# Altium schematic sheet BEE_BOARD_POWER.SchDoc
size Tabloid; DocumentNumber: 4; SheetNumber: 4; SheetTotal: 7; Sheet_Name: POWER; Size: 11x17
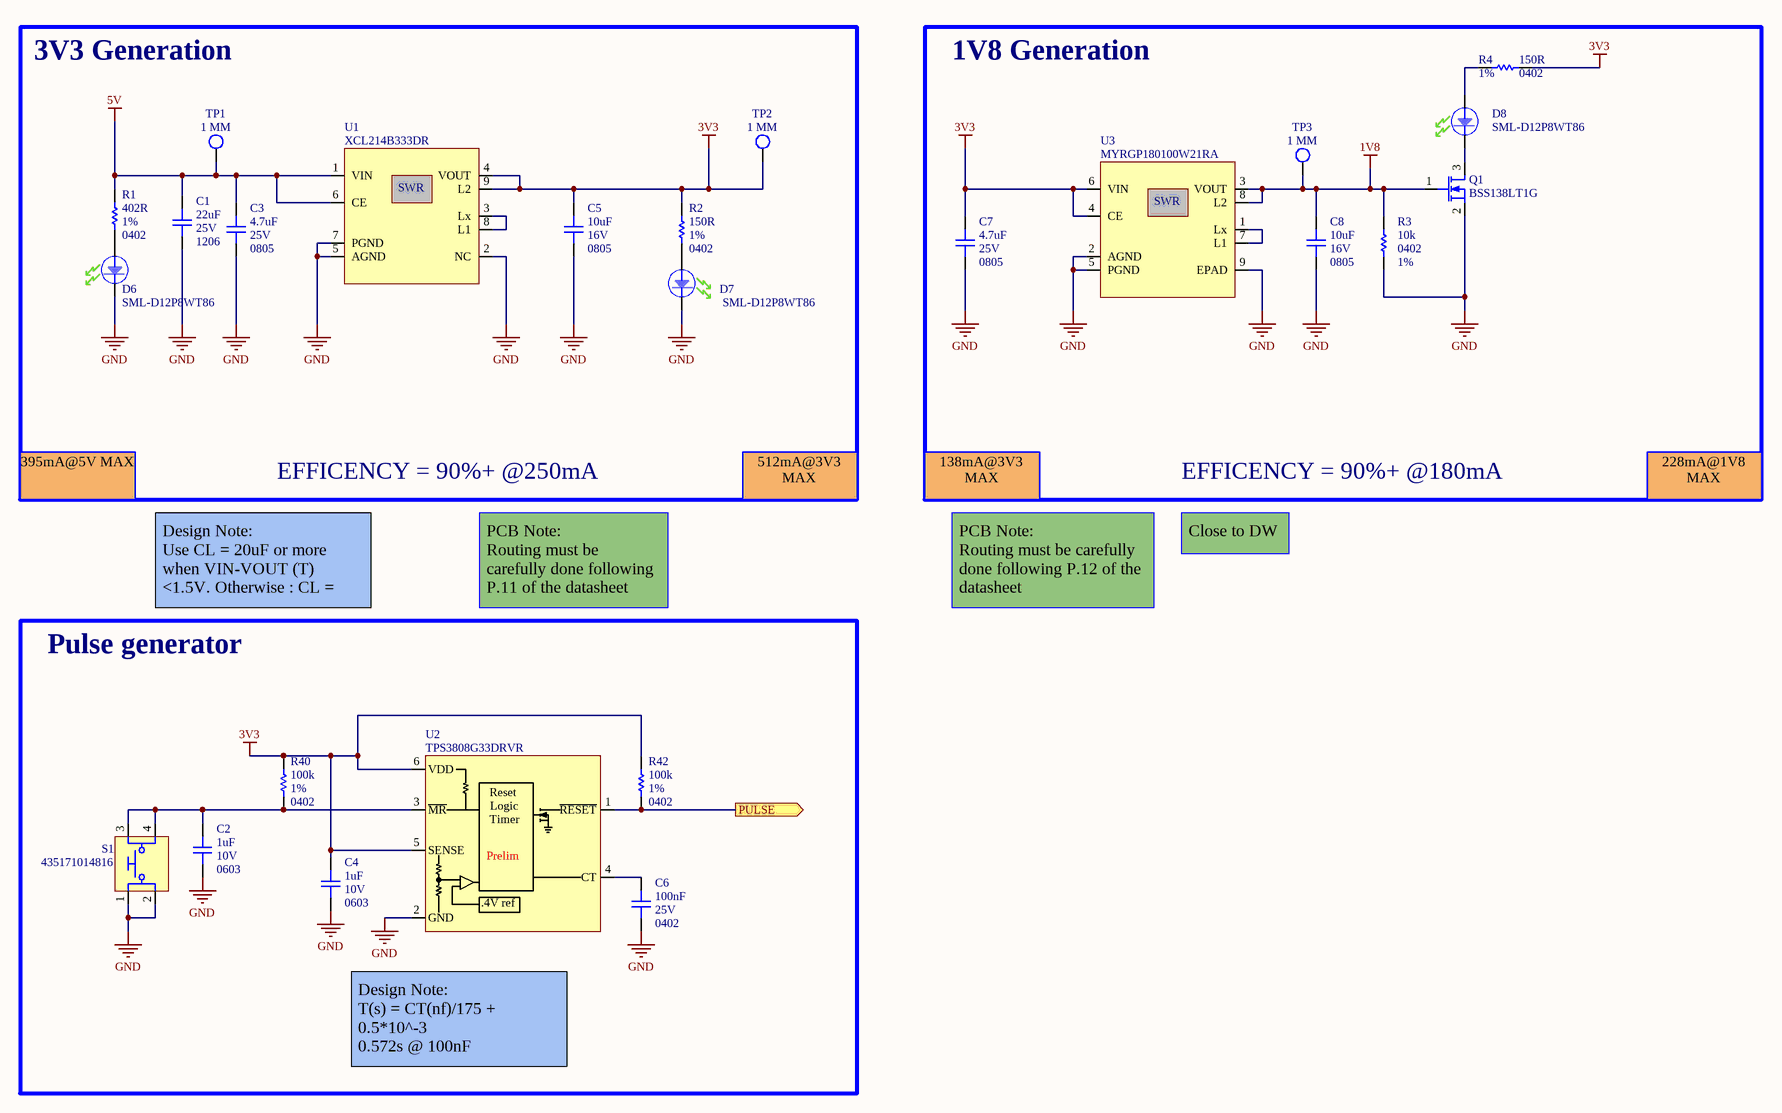
[diagram p0: BEE_BOARD_POWER.SchDoc]

## Parts
C1  value 22uF  Package: 1206  Voltage Rating: 25V  [CAP_CER_1206]  (hidden comment: CL31A226KAHNNNE)
C2  value 1uF  Package: 0603  Voltage Rating: 10V  [CAP_CER_0603]  (hidden comment: C0603C105K8PACTU)
C3  value 4.7uF  Package: 0805  Voltage Rating: 25V  [CAP_CER_0805]  (hidden comment: C2012X7R1E475K125AE)
C4  value 1uF  Package: 0603  Voltage Rating: 10V  [CAP_CER_0603]  (hidden comment: C0603C105K8PACTU)
C5  value 10uF  Package: 0805  Voltage Rating: 16V  [CAP_CER_0805]  (hidden comment: GRM21BR61C106KE15K)
C6  value 100nF  Package: 0402  Voltage Rating: 25V  [CAP_CER_0402]  (hidden comment: CGA2B3X7R1E104K050BB)
C7  value 4.7uF  Package: 0805  Voltage Rating: 25V  [CAP_CER_0805]  (hidden comment: C2012X7R1E475K125AE)
C8  value 10uF  Package: 0805  Voltage Rating: 16V  [CAP_CER_0805]  (hidden comment: GRM21BR61C106KE15K)
D6  SML-D12P8WT86  [LED_SML-D12P8WT86]
D7  SML-D12P8WT86  [LED_SML-D12P8WT86]
D8  SML-D12P8WT86  [LED_SML-D12P8WT86]
Q1  BSS138LT1G  [TRX_NMOS_BSS138LT1G]
R1  value 402R  Tolerance: 1%  Package: 0402  [RES_0402]  (hidden comment: ERJ-2RKF4020X)
R2  value 150R  Tolerance: 1%  Package: 0402  [RES_0402]  (hidden comment: RC0402FR-07150RL)
R3  value 10k  Tolerance: 1%  Package: 0402  [RES_0402]  (hidden comment: RC0402FR-0710KL)
R4  value 150R  Tolerance: 1%  Package: 0402  [RES_0402]  (hidden comment: RC0402FR-07150RL)
R40  value 100k  Tolerance: 1%  Package: 0402  [RES_0402]  (hidden comment: RC0402FR-07100KL)
R42  value 100k  Tolerance: 1%  Package: 0402  [RES_0402]  (hidden comment: RC0402FR-07100KL)
S1  435171014816  [SWI_TACT_435171014816]
TP1  1 MM  [TPO_SMD_ROUND_1MM]  (no BOM)
TP2  1 MM  [TPO_SMD_ROUND_1MM]  (no BOM)
TP3  1 MM  [TPO_SMD_ROUND_1MM]  (no BOM)
U1  XCL214B333DR  [REG_SWR_XCL214B333DR]
U2  TPS3808G33DRVR  [POW_TPS3808G33DRVR]
U3  MYRGP180100W21RA  [REG_SWR_MYRGP180100W21RA]

## Blocks framed on the sheet
3V3 Generation: C1 C3 C5 D6 D7 R1 R2 TP1 TP2 U1
1V8 Generation: C7 C8 D8 Q1 R3 R4 TP3 U3
Pulse generator: C2 C4 C6 R40 R42 S1 U2

## Ports
PULSE (out)

## Nets
1V8: C8.2 Q1.1(G) R3.1 TP3.1 U3.3(VOUT) U3.8(L2)
3V3: C4.1 C5.2 C7.2 R2.2 R4.1 R40.2 R42.2 TP2.1 U1.4(VOUT) U1.9(L2) U2.5(SENSE) U2.6(VDD) U3.4(CE) U3.6(VIN)
5V: C1.2 C3.2 R1.2 TP1.1 U1.1(VIN) U1.6(CE)
GND: C1.1 C2.2 C3.1 C4.2 C5.1 C6.1 C7.1 C8.1 D6.K D7.K Q1.2(S) R3.2 S1.1 S1.2 U1.2(NC) U1.5(AGND) U1.7(PGND) U2.2(GND) U3.2(AGND) U3.5(PGND) U3.9(EPAD)
PULSE: R42.1 U2.1(~{RESET}) ; port PULSE
NetC2_1: C2.1 R40.1 S1.3 S1.4 U2.3(~{MR})
NetC6_2: C6.2 U2.4(CT)
NetD6_A: D6.A R1.1
NetD7_A: D7.A R2.1
NetD8_A: D8.A R4.2
NetD8_K: D8.K Q1.3(D)
NetU1_3: U1.3(Lx) U1.8(L1)
NetU3_1: U3.1(Lx) U3.7(L1)

## Notes on the sheet
- 395mA@5V MAX
- EFFICENCY = 90%+ @250mA
- 512mA@3V3 MAX
- 138mA@3V3 MAX
- EFFICENCY = 90%+ @180mA
- 228mA@1V8 MAX
- Design Note:
  Use CL = 20uF or more when VIN-VOUT (T) <1.5V. Otherwise : CL = 10uF
- PCB Note:
  Routing must be carefully done following P.11 of the datasheet
- PCB Note:
  Routing must be carefully done following P.12 of the datasheet
- Close to DW
- Design Note:
  T(s) = CT(nf)/175 + 0.5*10^-3
  0.572s @ 100nF
- Sheet Name
- Project Title
- Global Project
- Size
- Group
- Revision
- Date
- Sheet
- of
- Filename
- Designers
- (in symbol POW_TPS3808G33DRVR) Reset; Logic; Timer; Prelim; .4V ref
- (in symbol REG_SWR_MYRGP180100W21RA) SWR
- (in symbol REG_SWR_XCL214B333DR) SWR

## Library data of the parts
C1 = CAP_CER_CL31A226KAHNNNE: CAP - CER 22uF 10% 25V X5R - 1206; Manufacturer #1: Samsung Electro-Mechanics; GRAMS Lib Spec: 2.8; Magnetic Material: Unknown; Polarized: NO; Assembly Type: SMD; CreatedBy/Date: Philippe Arsenault/21 Janvier 2020; Current Rating: *; HelpURL: http://www.samsungsem.com/global/support/product-search/mlcc/1207445_4880.html; Manufacturer #2: *; Note: *; Part Number #1: CL31A226KAHNNNE; Part Number #2: 1276-3047-1-ND; Power Max: *; Temperature: -55°C ~ 85°C; Tolerance: 10%; VerifiedBy: C.Paulin - 28/01/2020; Supplier 1: Digi-Key; Supplier Part Number 1: 1276-3047-1-ND; Cryo: UNKNOWN
C2 C4 = CAP_CER_C0603C105K8PACTU: CAP - CER 1uF 10V 10% X5R - 0603; Manufacturer #1: KEMET; GRAMS Lib Spec: 2.8; Magnetic Material: Unknown; Polarized: NO; Tolerance: 10%; Current Rating: *; Power Max: *; HelpURL: https://content.kemet.com/datasheets/KEM_C1006_X5R_SMD.pdf; CreatedBy/Date: Hubert Dube - 21/07/20; VerifiedBy: Louis-Daniel Gaulin - 21/07/20; Temperature: -55°C ~ 85°C; Manufacturer #2: *; Assembly Type: SMD; Part Number #2: *; Part Number #1: C0603C105K8PACTU; Cryo: UNKNOWN; Supplier 1: Digi-Key; Supplier Part Number 1: 399-3118-1-ND
C3 C7 = CAP_CER_C2012X7R1E475K125AE: CAP - CER 4.7UF 10% 25V X7R - 0805; Manufacturer #1: TDK Corporation; GRAMS Lib Spec: 2.8; Magnetic Material: Unknown; Polarized: No; Tolerance: 10%; Current Rating: *; Power Max: *; HelpURL: https://product.tdk.com/info/en/documents/chara_sheet/C2012X7R1E475K125AE.pdf; CreatedBy/Date: Keven Deslandes - 2018/11/09; VerifiedBy: Nicolas Roy - 2018/12/11; Temperature: -55°C ~ 125°C; Manufacturer #2: *; Note: *; Assembly Type: SMD; Part Number #2: *; Part Number #1: C2012X7R1E475K125AE; Supplier 1: Digi-Key; Supplier Part Number 1: 445-14537-1-ND; Cryo: UNKNOWN
C5 C8 = CAP_CER_GRM21BR61C106KE15K: CAP - CER 10UF 10% 16V X5R - 0805; Manufacturer #1: Murata; GRAMS Lib Spec: 2.8; Magnetic Material: Unknown; Polarized: NO; Assembly Type: SMD; CreatedBy/Date: Caroline Paulin / 8 août 2018; Current Rating: *; HelpURL: https://search.murata.co.jp/Ceramy/image/img/A01X/G101/ENG/GRM21BR61C106KE15-01.pdf; Manufacturer #2: *; Note: *; Part Number #1: GRM21BR61C106KE15K; Part Number #2: *; Power Max: *; Temperature: -55°C ~ 85°C; Tolerance: 10%; VerifiedBy: Nicolas V. (2019-01-22); Supplier 1: Digi-Key; Supplier Part Number 1: 490-6473-1-ND; Cryo: UNKNOWN
C6 = CAP_CER_CGA2B3X7R1E104K050BB: CAP - CER 0.1µF 10% 25V X7R - 0402; Manufacturer #1: TDK Corporation; GRAMS Lib Spec: 2.8; Magnetic Material: Unknown; Polarized: NO; Assembly Type: SMD; CreatedBy/Date: Nicolas Roy 2018-11-07; Current Rating: *; HelpURL: https://product.tdk.com/info/en/catalog/datasheets/mlcc_automotive_general_en.pdf; Manufacturer #2: *; Note: *; Part Number #1: CGA2B3X7R1E104K050BB; Part Number #2: *; Power Max: *; Temperature: -55°C ~ 125°C; Tolerance: 10%; VerifiedBy: Nicolas V. (2019-01-22); Supplier 1: Digi-Key; Supplier Part Number 1: 445-6902-1-ND; Cryo: UNKNOWN
D6-D8 = LED_SML-D12P8WT86: LED - GREEN DIFFUSED 0603 SMD - 0603; Manufacturer #1: Rohm Semiconductor; Current Rating: 1-20mA; Note: Operate at 2mA; Value: 560 nm (green); Voltage rating: 2.2V (Forward), 5V (max Reverse); Polarized: Yes; Magnetic Material: Unknown; GRAMS Lib Spec: 2.8; Manufacturer #2: *; Power Max: *; Part Number #1: SML-D12P8WT86; Part Number #2: *; HelpURL: https://d1d2qsbl8m0m72.cloudfront.net/en/products/databook/datasheet/opto/led/chip_mono/sml-d12x8_d13x8-e.pdf; Supplier 1: Digi-Key; Supplier Part Number 1: 511-1579-2-ND; Assembly Type: SMD; Temperature: -40 ~ 85 °C; Package: 0603; CreatedBy/Date: Keven Deslandes - 2018/11/21; Tolerance: *; VerifiedBy: Caroline Paulin - 13 février 2019; Cryo: UNKNOWN
Q1 = TRX_NMOS_BSS138LT1G: TRX - NMOS - 50V 200MA - SOT−23-3; Manufacturer #1: ON Semiconductor; GRAMS Lib Spec: 2.8; Magnetic Material: Unknown; Polarized: Yes; Power Max: 225mW; Assembly Type: SMD; CreatedBy/Date: Joel Lemay 2018-06-15; Current Rating: 200mA; HelpURL: http://www.onsemi.com/pub/Collateral/BSS138LT1-D.PDF; Manufacturer #2: *; Package: SOT-23-3; Part Number #1: BSS138LT1G; Part Number #2: *; Supplier 1: Digi-Key; Supplier Part Number 1: BSS138LT1GOSCT-ND; Temperature: -55°C ~ 150°C; Tolerance: *; Value: *; VerifiedBy: Caroline Paulin - 6 sept 2018; Voltage Rating: 50V; Cryo: UNKNOWN
R1 = RES_ERJ-2RKF4020X: RES - 402R 1% 1/10W - 0402; Manufacturer #1: Panasonic Electronic Components; GRAMS Lib Spec: 2.8; Magnetic Material: Unknown; Polarized: No; Voltage Rating: 50V; Assembly Type: SMD; CreatedBy/Date: Keven Deslandes 2018-09-20; Current Rating: *; HelpURL: https://industrial.panasonic.com/ww/products/resistors/chip-resistors/general-purpose-chip-resistors/precision-thick-film-chip-resistors/ERJ2RKF4020X; Manufacturer #2: *; Part Number #1: ERJ-2RKF4020X; Part Number #2: *; Power Max: 1/10W; Temperature: -55°C ~ 155°C; VerifiedBy: Caroline Paulin - 18/12/2018; Supplier 1: Digi-Key; Supplier Part Number 1: P402LCT-ND; Cryo: UNKNOWN
R2 R4 = RES_RC0402FR-07150RL: RES - 150R 1% 1/16W - 0402; Manufacturer #1: Yageo; GRAMS Lib Spec: 2.8; Magnetic Material: Unknown; Polarized: No; Voltage Rating: 50V; Assembly Type: SMD; CreatedBy/Date: Jonathan Bouchard 2019-03-25; Current Rating: *; HelpURL: http://www.yageo.com/documents/recent/PYu-RC_Group_51_RoHS_L_10.pdf; Manufacturer #2: *; Part Number #1: RC0402FR-07150RL; Part Number #2: *; Power Max: 1/16W; Temperature: -55°C ~ 155°C; VerifiedBy: Nicolas V. (2019-05-02); Supplier 1: Digi-Key; Supplier Part Number 1: 311-150LRCT-ND; Cryo: UNKNOWN
R3 = RES_RC0402FR-0710KL: RES - 10K OHMS 1% 1/16W - 0402; Manufacturer #1: Yageo; GRAMS Lib Spec: 2.8; Magnetic Material: UNKNOWN; Polarized: NO; Voltage Rating: 50V; Assembly Type: SMD; CreatedBy/Date: Nicolas V. (2018-11-20); Current Rating: *; HelpURL: http://www.yageo.com/documents/recent/PYu-RC_Group_51_RoHS_L_9.pdf; Manufacturer #2: *; Note: *; Part Number #1: RC0402FR-0710KL; Part Number #2: *; Power Max: 1/16W; Temperature: -55°C ~ 155°C; VerifiedBy: Nicolas V. (2018-11-20); Supplier 1: Digi-Key; Supplier Part Number 1: 311-10.0KLRCT-ND; Cryo: UNKNOWN
R40 R42 = RES_RC0402FR-07100KL: RES - 100K 1% 1/16W - 0402; Manufacturer #1: Yageo; GRAMS Lib Spec: 2.8; Magnetic Material: Unknown; Polarized: No; Voltage Rating: 50V; Assembly Type: SMD; CreatedBy/Date: Keven Deslandes 2018-10-19; Current Rating: *; HelpURL: http://www.yageo.com/documents/recent/PYu-RC_Group_51_RoHS_L_9.pdf; Manufacturer #2: *; Part Number #1: RC0402FR-07100KL; Part Number #2: *; Power Max: 1/16W; Temperature: -55°C ~ 155°C; VerifiedBy: Caroline Paulin - 18/12/2018; Supplier 1: Digi-Key; Supplier Part Number 1: 311-100KLRCT-ND; Cryo: UNKNOWN
S1 = SWI_TACT_435171014816: SWI - SWITCH TACTILE SPST-NO 0.05A 12V -SMD; Manufacturer #1: Würth Elektronik; Current Rating: 50mA; Voltage rating: 12VDC; Polarized: No; Magnetic Material: UNKNOWN; GRAMS Lib Spec: 2.8; Manufacturer #2: *; Power Max: *; Value: SPST-NO; Part Number #1: 435171014816; Part Number #2: *; HelpURL: https://www.we-online.com/catalog/datasheet/435171014816.pdf; Supplier 1: Digi-Key; Supplier Part Number 1: 732-435171014816CT-ND; Assembly Type: SMD; Temperature: -40°C ~ 85°C; Package: SMD; CreatedBy/Date: Hubert Dube - 22/07/20; Tolerance: *; VerifiedBy: Louis-Daniel Gaulin / 12-11-2020; Cryo: UNKNOWN
TP1-TP3 = TPO_SMD_ROUND_1MM: TPO - TEST POINT ROUND SMD PAD ONLY  - 1 MM; Magnetic Material: NO; GRAMS Lib Spec: 2.8; Cryo: UNKNOWN; Current Rating: *; Manufacturer #1: *; Manufacturer #2: *; Note: *; Power Max: *; Value: *; Part Number #1: *; Part Number #2: *; HelpURL: *; Polarized: *; Supplier 1: *; Assembly Type: NONE; Supplier Part Number 1: *; Package: 1 MM ROUND; CreatedBy/Date: Jonathan Bouchard 2018-07-17; Temperature: *; Tolerance: *; VerifiedBy: Arnaud Samson 23-07-18; Voltage Rating: *
U1 = REG_SWR_XCL214B333DR: REG_DC DC CONVERTER 3.3V 5W_9-PowerTFQFN; Manufacturer #1: Torex Semiconductor Ltd; Voltage Rating: 2.7V to 5.5V IN; Current Rating: 1.5A; GRAMS Lib Spec: 2.8; Magnetic Material: Unknown; Polarized: Yes; Value: 3.3V; Tolerance: *; Power Max: *; HelpURL: https://www.torexsemi.com/file/xcl213/XCL213-XCL214.pdf; CreatedBy/Date: Louis-Daniel Gaulin / 21-07-2020; VerifiedBy: Philippe Arsenault/2020-11-06; Temperature: -40°C ~ 105°C; Package: 9-PowerTFQFN; Manufacturer #2: *; Note: *; Assembly Type: SMD; Part Number #2: *; Part Number #1: XCL214B333DR; Supplier 1: Digi-Key; Supplier Part Number 1: 893-1218-1-ND; Cryo: UNKNOWN
U2 = POW_TPS3808G33DRVR: POW - Programmable-Delay Supervisory Circuit - 6WSON; Manufacturer #1: Texas Instruments; GRAMS Lib Spec: 2.8; Magnetic Material: Unknown; Polarized: Yes; Value: *; Tolerance: *; Voltage Rating: *; Current Rating: *; Power Max: *; HelpURL: http://www.ti.com/lit/ds/symlink/tps3808.pdf; CreatedBy/Date: Philippe Arsenault/2021-04-19; Temperature: -40°C ~ 125°C; Package: 6-WSON; Manufacturer #2: *; Assembly Type: SMD; Part Number #2: *; Part Number #1: TPS3808G33DRVR; Cryo: UNKNOWN; Supplier 1: Digi-Key; Supplier Part Number 1: 296-36792-1-ND
U3 = REG_SWR_MYRGP180100W21RA: REG_DC DC CONVERTER 1.8V 1.8W_8-PowerTDFN; Manufacturer #1: Murata Power Solutions Inc.; Voltage Rating: 2.5V to 5.5V IN; Current Rating: 1A; GRAMS Lib Spec: 2.8; Magnetic Material: Unknown; Polarized: Yes; Value: 1.8V; Tolerance: *; Power Max: *; HelpURL: https://www.murata.com/products/productdata/8807036026910/MYRGP-b-w.pdf?1583754814000; CreatedBy/Date: Louis-Daniel Gaulin / 21-07-2020; VerifiedBy: Philippe Arsenault/2020-11-06; Temperature: -40°C~105°C; Package: 8-PowerTDFN; Manufacturer #2: *; Note: *; Assembly Type: SMD; Part Number #2: *; Part Number #1: MYRGP180100W21RA; Supplier 1: Digi-Key; Supplier Part Number 1: 811-MYRGP180100W21RACT-ND; Cryo: UNKNOWN